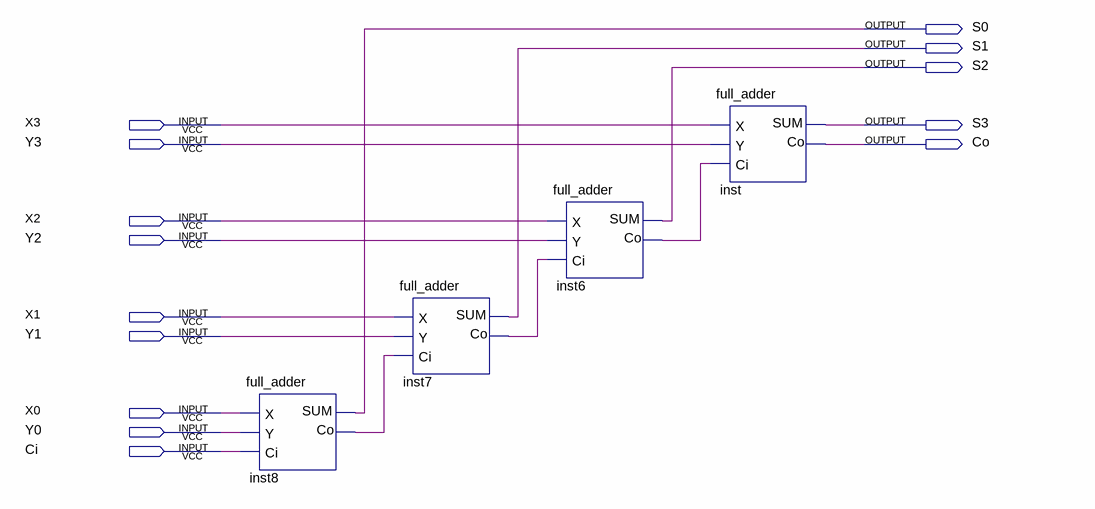
[diagram p0: schematic sheet]
// Quartus schematic adder_4bit.bdf as structural Verilog: 4 symbols, 14 pins
module adder_4bit (
  input  X3,
  input  Y3,
  input  X2,
  input  Y2,
  input  X1,
  input  Y1,
  input  X0,
  input  Y0,
  input  Ci,
  output S0,
  output S1,
  output S2,
  output S3,
  output Co
);

  wire inst6_co, inst7_co, inst8_co;

  full_adder inst8 (.X(X0), .Y(Y0), .Ci(Ci), .SUM(S0), .Co(inst8_co));
  full_adder inst7 (.X(X1), .Y(Y1), .Ci(inst8_co), .SUM(S1), .Co(inst7_co));
  full_adder inst6 (.X(X2), .Y(Y2), .Ci(inst7_co), .SUM(S2), .Co(inst6_co));
  full_adder inst (.X(X3), .Y(Y3), .Ci(inst6_co), .SUM(S3), .Co(Co));
endmodule
